# Altium project Meas_Board.PrjPcb
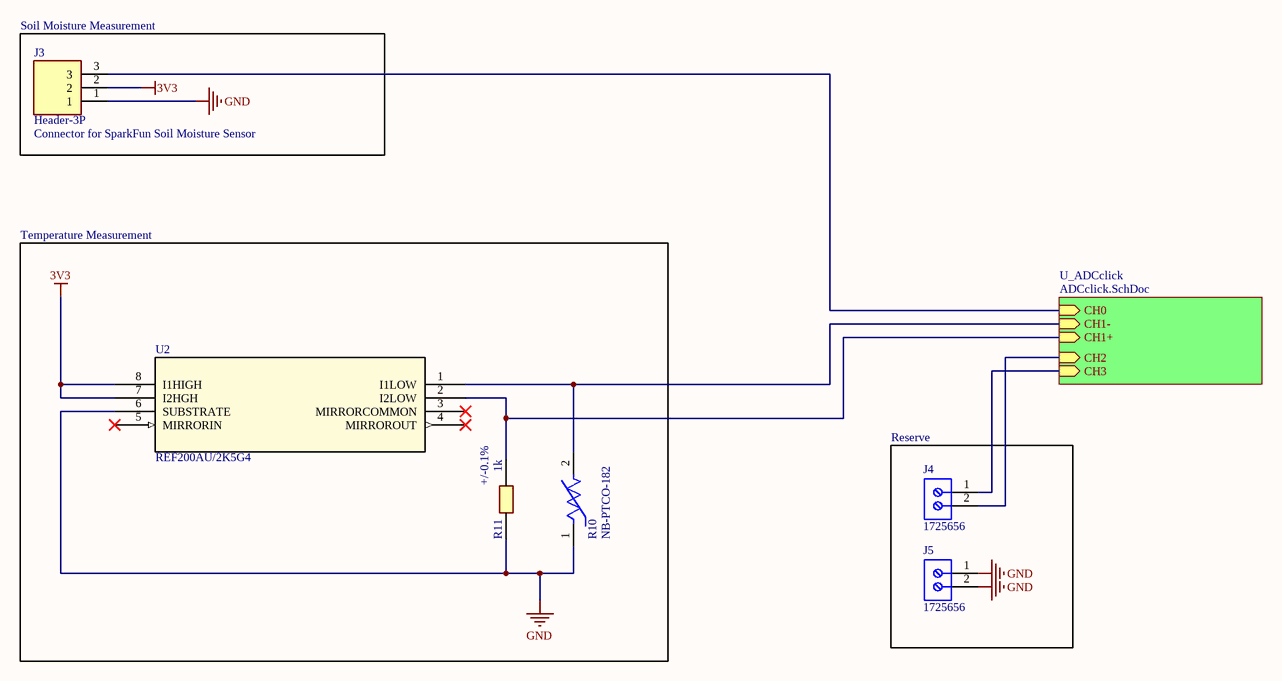
[diagram p0: Meas_Board.SchDoc]
2 sheets, 28 parts. Net scope: hierarchical (ports join the sheet entries above them; power ports are global).
Board file: Meas_Board.PcbDoc
Sheets:
  Meas_Board.SchDoc
    U_ADCclick = ADCclick.SchDoc

## Sheet Meas_Board.SchDoc
size A4; SheetNumber: 1; SheetTotal: 2

### Parts
J3  Header-3P  [HDRV3W64P254_1X3_762X241X838P]
J4  1725656  [PHOE-1725656-2]
J5  1725656  [PHOE-1725656-2]
R10  NB-PTCO-182  [FP-PTFF-MFG]
R11  value 1k  Tolerance: +/-0.1%  [IMP-0805]  (hidden comment: Res_generic)
U2  REF200AU/2K5G4  [D8_TEX]

### Blocks framed on the sheet
Temperature Measurement: R10 R11 U2
Reserve: J4 J5

### Sub-sheets
U_ADCclick = ADCclick.SchDoc: CH0 (in), CH3 (in), CH2 (in), CH1- (in), CH1+ (in)

### Nets
3V3: J3.2 U2.7(I2HGH) U2.8(I1HIGH)
GND: J3.1 J5.1 J5.2 R10.1 R11.1 U2.6(SUBSTRATE)
CH0: J3.3 ; sheet U_ADCclick/CH0
CH1+: R11.2 U2.2(I2LOW) ; sheet U_ADCclick/CH1+
CH1-: R10.2 U2.1(I1LOW) ; sheet U_ADCclick/CH1-
CH2: J4.2 ; sheet U_ADCclick/CH2
CH3: J4.1 ; sheet U_ADCclick/CH3

Not connected (* = marked no-connect by the designer): U2 3(MIRRORCOMMON)* 4(MIRROROUT)* 5(MIRRORIN)*

### Notes on the sheet
- (near J3) Soil Moisture Measurement
- (near J3) Connector for SparkFun Soil Moisture Sensor

### Library data of the parts
J3 = Header-3P: Connector; Manufacturer_Name: SAMTEC; Manufacturer_Part_Number: TSW-103-07-S-S-LL; Datasheet Link: http://suddendocs.samtec.com/catalog_english/tsw_th.pdf; Height: 8.38mm; Mouser Part Number: 200-TSW10307SSLL; Mouser Price/Stock: https://www.mouser.co.uk/ProductDetail/Samtec/TSW-103-07-S-S-LL?qs=rU5fayqh%252BE2qFj1BrU5SIQ%3D%3D; Arrow Part Number: TSW-103-07-S-S-LL; Arrow Price/Stock: https://www.arrow.com/en/products/tsw-103-07-s-s-ll/samtec?region=nac
J4 J5 = CMP-2000-05299-1: Male Header, Pitch 2.54 mm, 1 x 2 Position, Height 9 mm, Tail Length 3.5 mm; Manufacturer: Phoenix Contact; Number of contacts: 2; Content: 250pc(s); Pitch: 2.54mm; Industrial packaging: Yes; Colour: Green; Manufacturer part No.: 1725656; Type: MPT0,5/2-2,54; Datasheet URL: http://datasheet.octopart.com/1725656-Phoenix-Contact-datasheet-5302866.pdf; Manufacturer URL: http://www.phoenixcontact.com/; Datasheet Version: Apr-08
R10 = CMP-03790-88648364-1: NB-PTCO-182 Pt1000, 2.0X4.0, Class B, Ptff102B1A0; Manufacturer Lifecycle Status: ACTIVE; NexarPartId: 88648364; Lifecycle Status: Production
R11 = Res_generic: Resistor; Power: 125 mW; Temperature Coefficent: 25 ppm/°C
U2 = REF200AU2K5G4: Description; Manufacturer_Name: Texas Instruments; Copyright: Copyright (C) 2026 Ultra Librarian. All rights reserved.; Manufacturer_Part_Number: REF200AU/2K5G4; RefDes: RefDes; Type: Type

## Sheet ADCclick.SchDoc
size A4; SheetNumber: 2; SheetTotal: 2
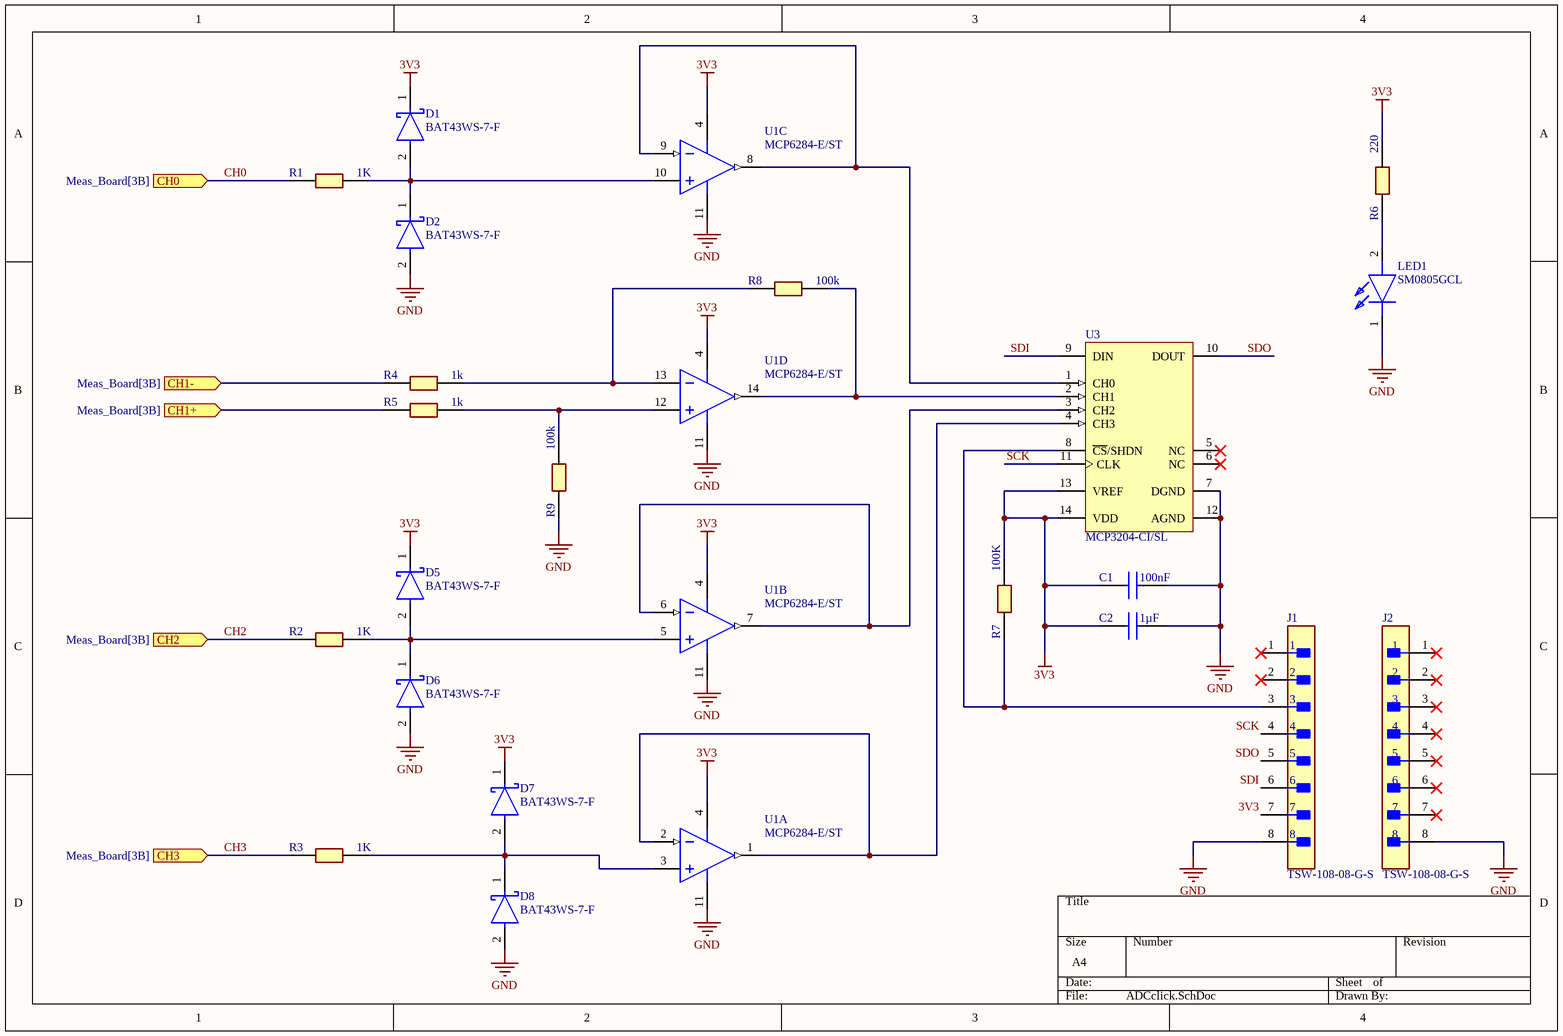
[diagram p1: ADCclick.SchDoc]

### Parts
C1  value 100nF  [IMP_0603]  (hidden comment: Cap_Generic)
C2  value 1µF  [IMP_0805]  (hidden comment: Cap_Generic)
D1  BAT43WS-7-F  [FP-SOD323-MFG]
D2  BAT43WS-7-F  [FP-SOD323-MFG]
D5  BAT43WS-7-F  [FP-SOD323-MFG]
D6  BAT43WS-7-F  [FP-SOD323-MFG]
D7  BAT43WS-7-F  [FP-SOD323-MFG]
D8  BAT43WS-7-F  [FP-SOD323-MFG]
J1  TSW-108-08-G-S  [FP-TSW-108-08-G-S-MFG]
J2  TSW-108-08-G-S  [FP-TSW-108-08-G-S-MFG]
LED1  SM0805GCL  [LEDC2012X80N]
R1  value 1K  [IMP-0603]  (hidden comment: Res_generic)
R2  value 1K  [IMP-0603]  (hidden comment: Res_generic)
R3  value 1K  [IMP-0603]  (hidden comment: Res_generic)
R4  value 1k  [IMP-0805]  (hidden comment: Res_generic)
R5  value 1k  [IMP-0805]  (hidden comment: Res_generic)
R6  value 220  [IMP-0805]  (hidden comment: Res_generic)
R7  value 100K  [IMP-0603]  (hidden comment: Res_generic)
R8  value 100k  [IMP-0603]  (hidden comment: Res_generic)
R9  value 100k  [IMP-0805]  (hidden comment: Res_generic)
U1  MCP6284-E/ST  [TSSOP-ST14_M]  (parts A,B,C,D of 4)
U3  MCP3204-CI/SL  [SOIC-SL14_L]

### Ports
CH0 (in, see Meas_Board[3B]), CH1+ (in, see Meas_Board[3B]), CH1- (in, see Meas_Board[3B]), CH2 (in, see Meas_Board[3B]), CH3 (in, see Meas_Board[3B])

### Nets
3V3: C1.1 C2.1 D1.1(C) D5.1(C) D7.1(C) J1.7 R6.2 R7.2 U1.4(VDD) U3.13(VREF) U3.14(VDD)
GND: C1.2 C2.2 D2.2(A) D6.2(A) D8.2(A) J1.8 J2.8 LED1.1(K) R9.1 U1.11(VSS) U3.7(DGND) U3.12(AGND)
CH0: R1.1 ; port CH0
CH1+: R5.1 ; port CH1+
CH1-: R4.1 ; port CH1-
CH2: R2.1 ; port CH2
CH3: R3.1 ; port CH3
SCK: J1.4 U3.11(CLK)
SDI: J1.6 U3.9(DIN)
SDO: J1.5 U3.10(DOUT)
NetD1_2: D1.2(A) D2.1(C) R1.2 U1.10(VINC+)
NetD5_2: D5.2(A) D6.1(C) R2.2 U1.5(VINB+)
NetD7_2: D7.2(A) D8.1(C) R3.2 U1.3(VINA+)
NetJ1_3: J1.3 R7.1 U3.8(~{CS}/SHDN)
NetLED1_2: LED1.2(A) R6.1
NetR4_2: R4.2 R8.1 U1.13(VIND-)
NetR5_2: R5.2 R9.2 U1.12(VIND+)
NetR8_2: R8.2 U1.14(VOUTD) U3.2(CH1)
NetU1_1: U1.1(VOUTA) U1.2(VINA-) U3.4(CH3)
NetU1_6: U1.6(VINB-) U1.7(VOUTB) U3.3(CH2)
NetU1_8: U1.8(VOUTC) U1.9(VINC-) U3.1(CH0)

Not connected (* = marked no-connect by the designer): J1 1* 2*; J2 1* 2* 3* 4* 5* 6* 7*; U3 5(NC)* 6(NC)*

### Library data of the parts
C1 C2 = Cap_Generic: Capacitor; Rated Voltage: 1kV; Ceramic Type: X7R; Tolerance: +/-10%
D1 D2 D5-D8 = CMP-12790-000055-1: DIODE SCHOTTKY 30V 200MA SOD323; Manufacturer: Diodes Inc.; Capacitance: 10pF; Max Surge Forward Current: 4A; Automotive Grade: Grade 1; Value: 10pF; Peak Reverse Current: 0.5uA; Standoff Height: 0.05mm; Max Junction Temp: +125°C; ComponentLink2Description: Datasheet; Max Repetitive Reverse Voltage: 30V; ComponentLink2URL: https://www.diodes.com/assets/Datasheets/ds30100.pdf; Mouser Description: Schottky Diodes & Rectifiers 30V 200mW; Temperature Range Low: -55°C; Automotive: Yes; RoHS: TRUE; Device Class L3: Schottky Diodes; Footprint Url: https://www.diodes.com/assets/Package-Files/SOD323.pdf; Temperature: -55°C to +125°C; Package: SOD323; Manufacturer Part Number: BAT43WS-7-F; Digikey Description: DIODE SCHOTTKY 30V 200MA SOD323; Height: 1.2mm; Temperature Range High: +125°C; Forward Current: 200mA; Device Class L2: Diodes; Octopart: https://octopart.com/bat43ws-7-f-diodes+inc.-326114; Device Class L1: Discrete Semiconductors; Reverse Voltage: 30V; Category: Diode; Lead Free: Yes
J1 J2 = CMP-02766-000001-1: CONN HEADER VERT 8POS 2.54MM; Manufacturer: Samtec; Number Of Contacts: 8; Conn Orientation: Straight; Conn Gender: Male; Device Class L1: Connectors; ComponentLink2Description: Datasheet; Digikey Description: CONN HEADER VERT 8POS 2.54MM; ComponentLink2URL: http://suddendocs.samtec.com/catalog_english/tsw_th.pdf; Temperature: -55°C to +125°C; RoHS: TRUE; Mouser Description: TSW - Samtec 2.54mm Pin Header 13.46mm Overall Pin Length 5.08mm Tail; Automotive: No; Temperature Range High: +125°C; Package: TSW-108-08-G-S; Device Class L3: unset; Manufacturer Part Number: TSW-108-08-G-S; Pitch: 2.54mm; Number Of Rows: 1; Lead Free: Yes; Height: 8.71mm; Contact Material: Gold,Nickel; Footprint Url: http://suddendocs.samtec.com/prints/tsw-xxx-xx-x-x-xx-xxx-footprint.pdf; Temperature Range Low: -55°C; Octopart: https://octopart.com/tsw-108-08-g-s-samtec-272653; Category: Conn; Device Class L2: Headers and Wire Housings
LED1 = SM0805GCL: LED; Manufacturer_Name: Bivar; Datasheet Link: https://datasheet.datasheetarchive.com/originals/distributors/Datasheets-DGA13/1161700.pdf; Height: 0.8mm; Manufacturer_Part_Number: SM0805GCL; Mouser Part Number: 749-SM0805GCL; Mouser Price/Stock: https://www.mouser.co.uk/ProductDetail/Bivar/SM0805GCL?qs=jaLxTFIJCitl%252Bw30syUp6A%3D%3D; Arrow Part Number: SM0805GCL; Arrow Price/Stock: https://www.arrow.com/en/products/sm0805gcl/bivar?region=nac
R1-R9 = Res_generic: Resistor; Tolerance: +/-1%; Power: 125 mW; Temperature Coefficent: 25 ppm/°C
U1 = CMP-0187-00065-3: None; Unity Gain Bandwidth Product: 5MHz; Number of Channels: 4; Amplifier Type: GENERAL PURPOSE; Min Supply Voltage: 2.2V; Supply Current: 450uA; Voltage Gain: 110dB; Output Current: 25mA; Max Supply Voltage: 5.5V; Common Mode Rejection Ratio: 70dB; Slew Rate-Nom: 2.5V/µs; Input Offset Voltage-Max: 5mV; Input Offset Voltage (Vos): 3mV; Input Bias Current: 1pA; Max Operating Temperature: 125°C; Number of Pins: 14; Packaging: Rail/Tube; Technology: CMOS; Mount: Surface Mount; Min Operating Temperature: -40°C; Package Quantity: 96; Length: 5mm; Bandwidth: 5MHz; Radiation Hardening: No; Lead Free: Lead Free; RoHS Compliant: Yes; Number of Elements: 4; Nominal Supply Current: 450uA; Number of Circuits: 4; Height: 0.9mm; Width: 4.4mm; Case/Package: TSSOP; REACH SVHC: No SVHC; Slew Rate: 2.5V/µs; Gain Bandwidth Product: 5MHz; Power Supply Rejection Ratio (PSRR): 70dB; Number of Amplifiers: 4
U3 = CMP-0188-00361-2: 2.7V 4-Channel/8-Channel 12-Bit A/D Converters with SPI Serial Interface, 14-Pin SOIC 150mil, C Performance Grade, Industrial Temperature; ComponentLink2Description: Datasheet; ComponentLink3Description: Package Specification; PackageDescription: 14-Lead Plastic Small Outline (SL) - Narrow, 3.90mm Body [SOIC]; DatasheetVersion: revE, Sep-2008; ComponentLink1URL: http://www.microchip.com/; PackageVersion: revBB, Aug-2009; ComponentLink2URL: http://ww1.microchip.com/downloads/en/DeviceDoc/21298e.pdf; Code_JEDEC: MS-012-AB; Code_IPC: SOIC127P600-14; RevisionNote: URLs added.; PackageReference: SOIC-SL14; ComponentLink1Description: Manufacturer URL; ComponentLink3URL: http://www.microchip.com/stellent/groups/techpub_sg/documents/packagingspec/en012702.pdf

## Nets that join several sheets
3V3: Meas_Board (J3.2 U2.7 U2.8), ADCclick (11 pins)
GND: Meas_Board (6 pins), ADCclick (12 pins)
CH0: Meas_Board (J3.3), ADCclick (R1.1)
CH1+: Meas_Board (R11.2 U2.2), ADCclick (R5.1)
CH1-: Meas_Board (R10.2 U2.1), ADCclick (R4.1)
CH2: Meas_Board (J4.2), ADCclick (R2.1)
CH3: Meas_Board (J4.1), ADCclick (R3.1)